# Altium schematic sheet SpareSwitch.SchDoc
size A4
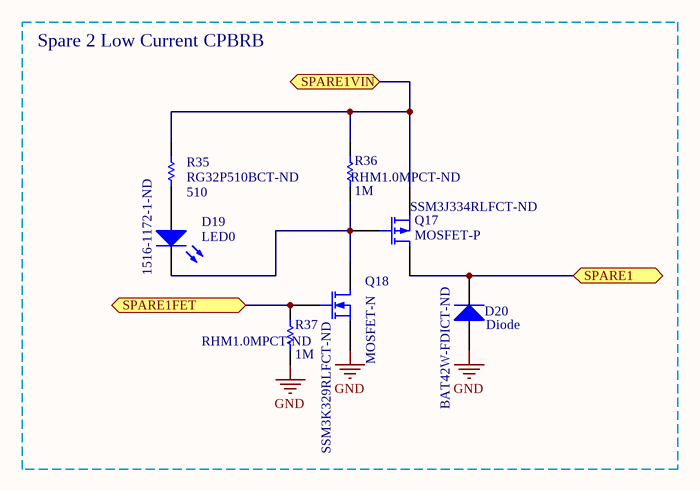
[diagram p0: SpareSwitch.SchDoc]

## Parts
D19  LED0  Supplier Part Number 1: 1516-1172-1-ND  [C1206]
D20  Diode  Supplier Part Number 1: BAT42W-FDICT-ND  [sod-123]
Q17  MOSFET-P  Supplier Part Number 1: SSM3J334RLFCT-ND  [SOT23f]
Q18  MOSFET-N  Supplier Part Number 1: SSM3K329RLFCT-ND  [SOT23f]
R35  value 510  Supplier Part Number 1: RG32P510BCT-ND  [C1206]  (hidden comment: 1206)
R36  value 1M  Supplier Part Number 1: RHM1.0MPCT-ND  [C1206]  (hidden comment: 1206)
R37  value 1M  Supplier Part Number 1: RHM1.0MPCT-ND  [C1206]  (hidden comment: 1206)

## Blocks framed on the sheet
Spare 2 Low Current CPBRB: D19 D20 Q17 Q18 R35-R37

## Ports
SPARE1 (bidir), SPARE1FET (bidir), SPARE1VIN (bidir)

## Nets
GND: D20.1(A) Q18.3(S) R37.1
SPARE1: D20.2(K) Q17.1(D) ; port SPARE1
SPARE1FET: Q18.2(G) R37.2 ; port SPARE1FET
SPARE1VIN: Q17.3(S) R35.1 R36.2 ; port SPARE1VIN
NetD19_1: D19.1(A) R35.2
NetD19_2: D19.2(K) Q17.2(G) Q18.1(D) R36.1

## Library data of the parts
D19 = LED0: Typical INFRARED GaAs LED; Published: 8-Jun-2000; LatestRevisionDate: 08-Jul-2005; LatestRevisionNote: Mech Layer 1 removed.; PackageReference: LED-0; Publisher: Altium Limited; PackageDescription: LED; 2 Leads; Supplier 1: Digi-Key
D20 = Diode: Default Diode; Published: 8-Jun-2000; LatestRevisionDate: 17-Jul-2002; LatestRevisionNote: Re-released for DXP Platform.; PackageVersion: Sep-1996; PackageReference: SMC; Publisher: Altium Limited; PackageDescription: DO-214-AB/SMC; 2 C-Bend Leads; Body 7.9 x 5.9 mm, inc. leads (LxW); Code_JEDEC: DO-214-AB; Supplier 1: Digi-Key
Q17 = MOSFET-P: P-Channel MOSFET; Published: 8-Jun-2000; LatestRevisionDate: 17-Jul-2002; LatestRevisionNote: Re-released for DXP Platform.; PackageVersion: 1995/1996; PackageReference: E3; Publisher: Altium Limited; PackageDescription: TO, Flat Index; 3 In-Line, Axial Leads; Body Dia. 4.6mm; Lead Dia. 0.5 mm (max); Supplier 1: Digi-Key
Q18 = MOSFET-N: N-Channel MOSFET; Published: 8-Jun-2000; LatestRevisionDate: 17-Jul-2002; LatestRevisionNote: Re-released for DXP Platform.; PackageVersion: 1995/1996; PackageReference: E3; Publisher: Altium Limited; PackageDescription: TO, Flat Index; 3 In-Line, Axial Leads; Body Dia. 4.6mm; Lead Dia. 0.5 mm (max); Supplier 1: Digi-Key
R35-R37 = Res1: Resistor; Published: 8-Jun-2000; LatestRevisionDate: 17-Jul-2002; LatestRevisionNote: Re-released for DXP Platform.; PackageReference: AXIAL-0.3; Publisher: Altium Limited; PackageDescription: Axial Device, Thru-Hole; 2 Leads; 0.3 in Pin Spacing; Supplier 1: Digi-Key